# EAGLE design CompleteEdition1 (EAGLE 9.6.2)
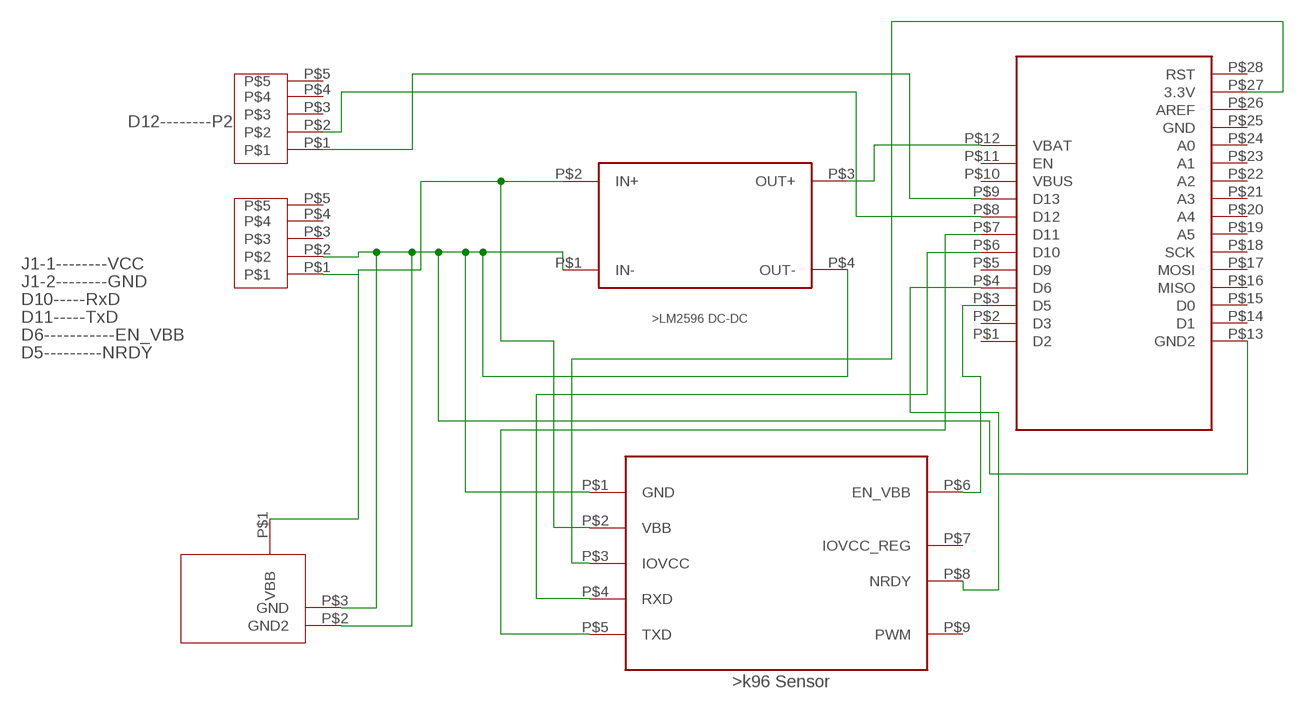
[diagram p0: schematic, sheet 1]

## Parts
DCDC1  DCDC  [DCDC]
FEATHER1  FEATHER  [FEATHER]
K96SENSOR1  K96SENSOR  [K96SENSOR]
PIN1  PIN  [PIN]
PIN2  PIN  [PIN]
U$1  POWER  [POWERIN]

## Nets
N$1: DCDC1.P$2(IN+) K96SENSOR1.P$2(VBB) PIN1.P$1 U$1.P$1(VBB)
N$2: DCDC1.P$1(IN-) DCDC1.P$4(OUT-) FEATHER1.P$13(GND2) K96SENSOR1.P$1(GND) PIN1.P$2 U$1.P$2(GND2) U$1.P$3(GND)
N$3: FEATHER1.P$6(D10) K96SENSOR1.P$4(RXD)
N$4: DCDC1.P$3(OUT+) FEATHER1.P$12(VBAT)
N$5: FEATHER1.P$7(D11) K96SENSOR1.P$5(TXD)
N$6: FEATHER1.P$4(D6) K96SENSOR1.P$8(NRDY)
N$7: FEATHER1.P$9(D13) PIN2.P$1
N$8: FEATHER1.P$3(D5) K96SENSOR1.P$6(EN_VBB)
N$9: FEATHER1.P$27(3.3V) K96SENSOR1.P$3(IOVCC)
N$10: FEATHER1.P$8(D12) PIN2.P$2
Unconnected: FEATHER1.P$1(D2) FEATHER1.P$2(D3) FEATHER1.P$5(D9) FEATHER1.P$10(VBUS) FEATHER1.P$11(EN) FEATHER1.P$14(D1) FEATHER1.P$15(D0) FEATHER1.P$16(MISO) FEATHER1.P$17(MOSI) FEATHER1.P$18(SCK) FEATHER1.P$19(A5) FEATHER1.P$20(A4) FEATHER1.P$21(A3) FEATHER1.P$22(A2) FEATHER1.P$23(A1) FEATHER1.P$24(A0) FEATHER1.P$25(GND) FEATHER1.P$26(AREF) FEATHER1.P$28(RST) K96SENSOR1.P$7(IOVCC_REG) K96SENSOR1.P$9(PWM) PIN1.P$3 PIN1.P$4 PIN1.P$5 PIN2.P$3 PIN2.P$4 PIN2.P$5

## Notes on the sheet
- D12--------P2
- J1-1--------VCC
- J1-2--------GND
- D10-----RxD
- D11-----TxD
- D6-----------EN_VBB
- D5---------NRDY

## Library data of the parts
DCDC1 = untitled:DCDC
FEATHER1 = untitled:FEATHER
K96SENSOR1 = untitled:K96SENSOR
PIN1 PIN2 = untitled:PIN
U$1 = untitled:POWER

## Board
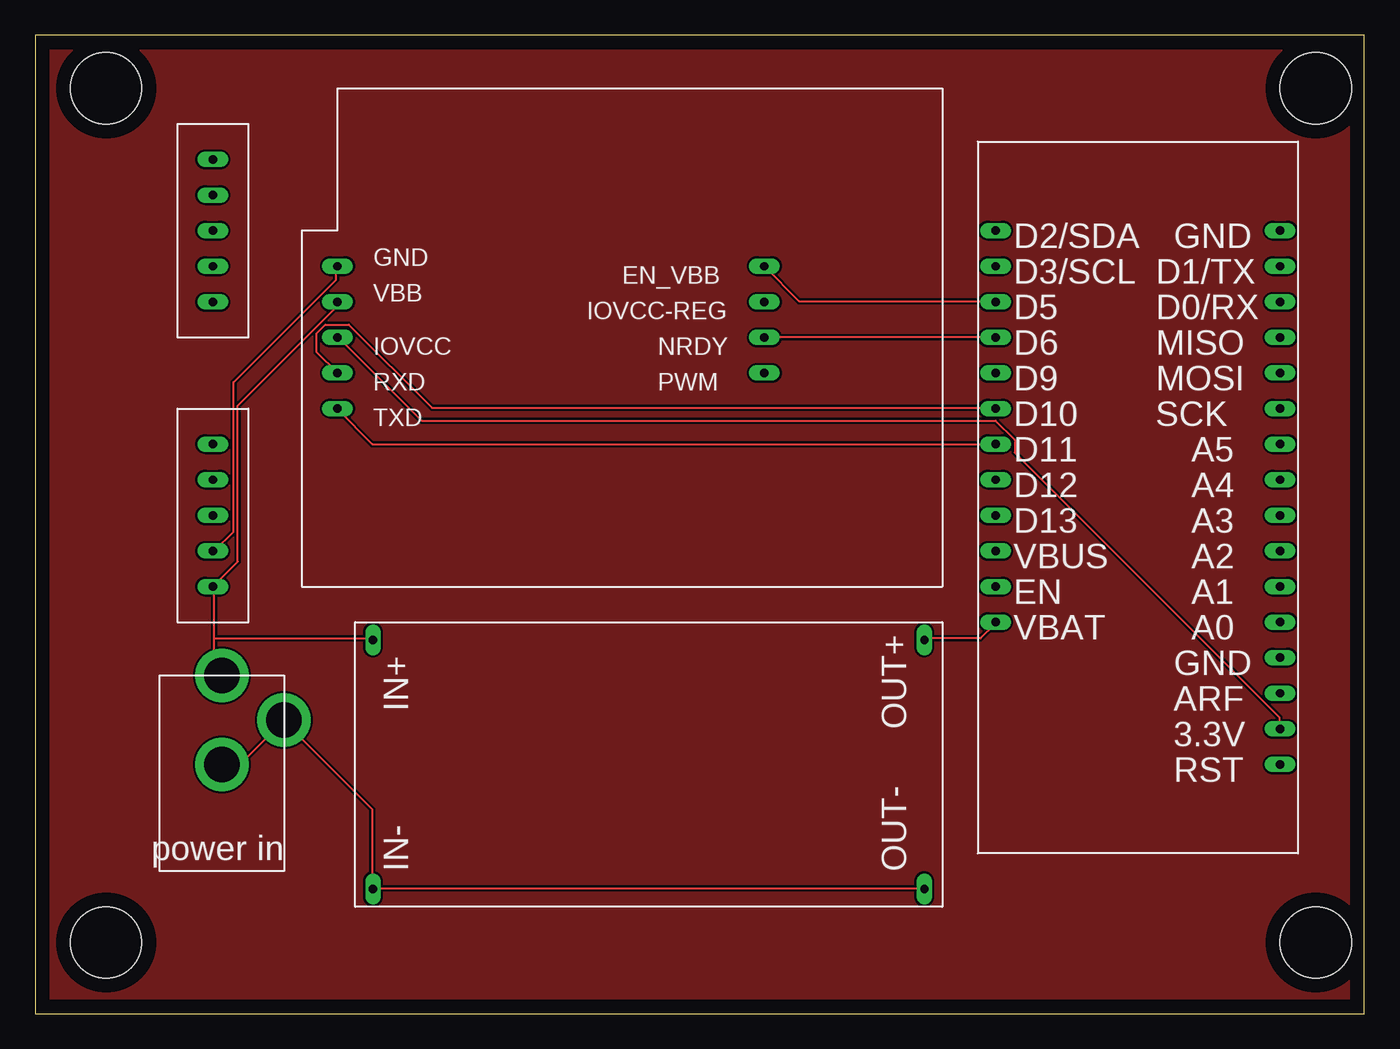
[diagram p1: board, top side]
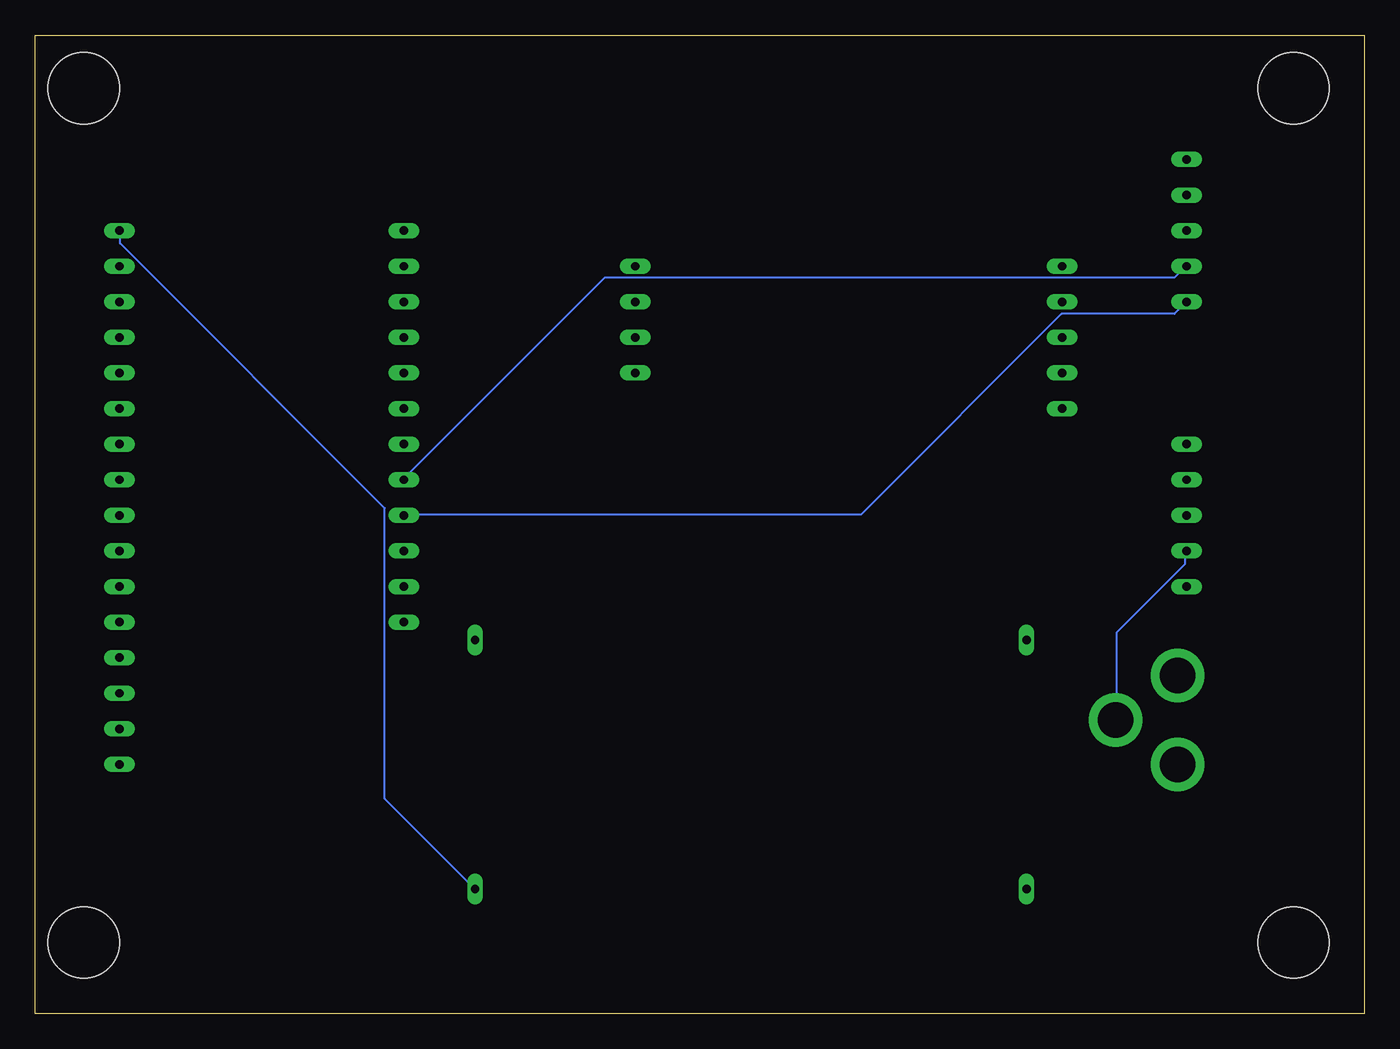
[diagram p2: board, bottom side, seen from below]

Size 94.92 x 69.84 mm. Coordinates in mm from the lower left corner, seen from the top.
Outline: 0,0 94.92,0 94.92,69.84 0,69.84 0,0
Copper layers (1*16): Top 0.035mm / dielectric 1.5mm / Bottom 0.035mm
Design rules "default": minimum track width 6mil, minimum drill 0.35mm, track to track 6mil, track to pad 6mil, pad to pad 6mil, via to via 6mil, smd to smd 6mil, copper to edge 40mil, drill to drill 6mil, minimum pad ring 10mil, minimum via ring 8mil, stop-mask expansion 4mil, vias tented up to drill 0mil, thermal gap 10mil
Holes 5.08 mm at 91.44,5.08 5.08,5.08 5.08,66.04 91.44,66.04

### Footprints (pad centres in the part's own frame; a part is rotated, then mirrored left to right if it is on the bottom)
DCDC = drill 0.6 long: P$1 -17.78,0; P$2 0,0; P$3 0,-39.37; P$4 -17.78,-39.37
FEATHER = drill 0.6 long: P$1 0,-5.08; P$2 0,-7.62; P$3 0,-10.16; P$4 0,-12.7; P$5 0,-15.24; P$6 0,-17.78; P$7 0,-20.32; P$8 0,-22.86; P$9 0,-25.4; P$10 0,-27.94; P$11 0,-30.48; P$12 0,-33.02; P$13 20.32,-5.08; P$14 20.32,-7.62; P$15 20.32,-10.16; P$16 20.32,-12.7; P$17 20.32,-15.24; P$18 20.32,-17.78; P$19 20.32,-20.32; P$20 20.32,-22.86; P$21 20.32,-25.4; P$22 20.32,-27.94; P$23 20.32,-30.48; P$24 20.32,-33.02; P$25 20.32,-35.56; P$26 20.32,-38.1; P$27 20.32,-40.64; P$28 20.32,-43.18
K96SENSOR = drill 0.6 long: P$1 -17.78,-5.08; P$2 -17.78,-7.62; P$3 -17.78,-10.16; P$4 -17.78,-12.7; P$5 -17.78,-15.24; P$6 12.7,-5.08; P$7 12.7,-7.62; P$8 12.7,-10.16; P$9 12.7,-12.7
PIN = drill 0.6 long: P$1 0,-7.62; P$2 0,-5.08; P$3 0,-2.54; P$4 0,0; P$5 0,2.54
POWERIN = drill 2.54 pad 3.81: P$1 4.445,-13.97; P$2 4.445,-7.62; P$3 0,-10.795

### Placement (x,y rotation side)
DCDC1  24.13,26.67 90 top
FEATHER1  68.58,60.96 0 top
K96SENSOR1  39.37,58.42 0 top
PIN1  12.7,38.1 0 top
PIN2  12.7,58.42 0 top
U$1  17.78,10.16 180 top

### Tracks (layer width: path | path; a pad name or v marks a point on that pad's centre or on a via)
GND
  pour Top: 0,69.85 95.25,69.85 95.25,0 0,0
N$1
  Top 0.152: 12.8,26.77 12.8,24.64 13.26,24.18 U$1.P$1 | 12.8,26.77 12.8,30.43 PIN1.P$1 14.48,32.26 14.48,43.38 21.49,50.39 21.49,50.7 K96SENSOR1.P$2 | 12.8,26.77 24.08,26.77 DCDC1.P$2
N$2
  Top 0.152: DCDC1.P$4 63.4,8.94 24.23,8.94 DCDC1.P$1 24.08,8.94 24.08,14.58 17.83,20.83 U$1.P$3 17.68,20.83 14.63,17.78 U$1.P$2 | K96SENSOR1.P$1 21.49,53.29 21.49,52.38 14.17,45.06 14.17,34.39 12.8,33.02 PIN1.P$2
  Bottom 0.152: PIN1.P$2 12.8,33.02 12.8,32.11 17.68,27.23 17.68,20.98 U$1.P$3 | DCDC1.P$4 69.95,15.34 69.95,36.07 88.85,54.97 88.85,55.88 FEATHER1.P$13
N$3
  Top 0.152: K96SENSOR1.P$4 20.12,47.19 20.12,48.57 20.73,49.17 22.4,49.17 28.35,43.23 68.58,43.23 FEATHER1.P$6
N$4
  Top 0.152: DCDC1.P$3 63.55,26.77 67.51,26.77 68.58,27.84 FEATHER1.P$12
N$5
  Top 0.152: FEATHER1.P$7 24.08,40.64 21.64,43.08 K96SENSOR1.P$5
N$6
  Top 0.152: FEATHER1.P$4 K96SENSOR1.P$8
N$7
  Bottom 0.152: PIN2.P$1 13.56,49.94 21.64,49.94 35.97,35.61 68.58,35.61 FEATHER1.P$9
N$8
  Top 0.152: K96SENSOR1.P$6 54.56,50.85 68.58,50.85 FEATHER1.P$3
N$9
  Top 0.152: FEATHER1.P$27 88.85,20.37 88.85,21.13 69.95,40.03 69.95,40.95 68.58,42.32 27.58,42.32 21.64,48.26 K96SENSOR1.P$3
N$10
  Bottom 0.152: FEATHER1.P$8 68.58,38.2 54.25,52.53 13.56,52.53 12.8,53.29 PIN2.P$2

### Text on the board
tValues: D12 | D13